# EAGLE design ProyectoFinal2 (EAGLE 9.4.0)
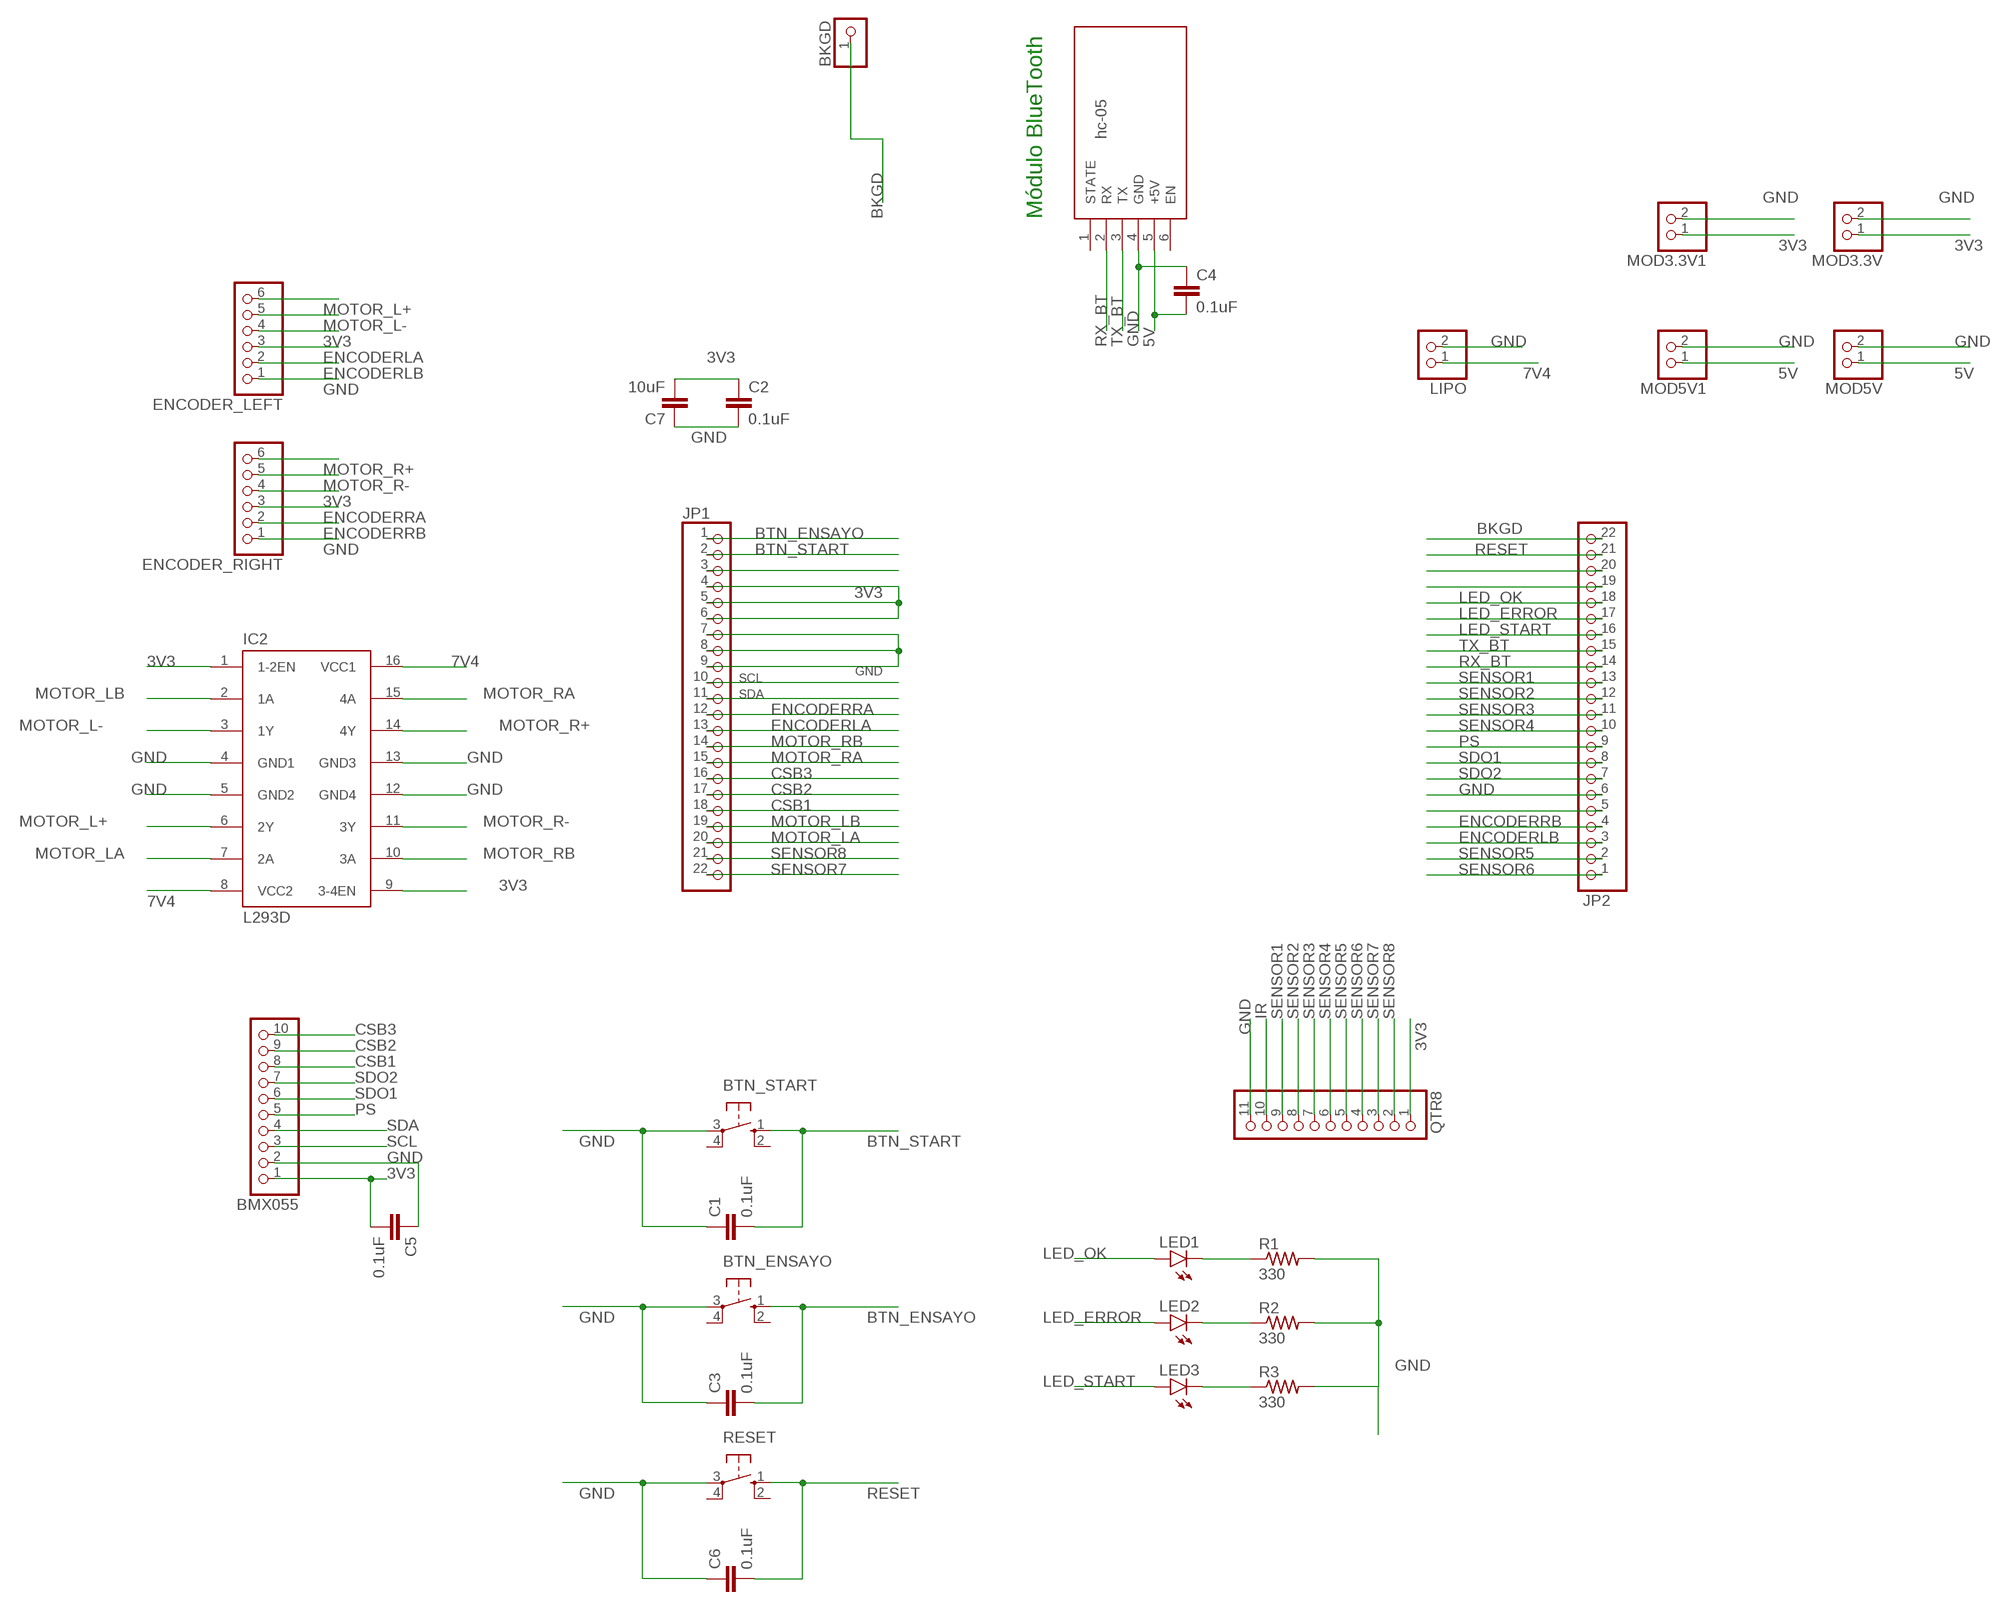
[diagram p0: schematic, sheet 1]

## Parts
BKGD  PINHD-1X1  [1X01]
BLUETOOTH  hc-05  WIRELESS-BLUETOOTH-HC-05  [WIRELESS-BLUETOOTH-HC-05]
BMX055  PINHD-1X10  [1X10]
BTN_ENSAYO  10-XX  [B3F-10XX]
BTN_START  10-XX  [B3F-10XX]
C1  0.1uF  C-EUC0805K  [C0805K]
C2  0.1uF  C-EUC0805K  [C0805K]
C3  0.1uF  C-EUC0805K  [C0805K]
C4  0.1uF  C-EUC0805K  [C0805K]
C5  0.1uF  C-EUC0805K  [C0805K]
C6  0.1uF  C-EUC0805K  [C0805K]
C7  10uF  C-EUC1206K  [C1206K]
ENCODER_LEFT  PINHD-1X6  [1X06]
ENCODER_RIGHT  PINHD-1X6  [1X06]
IC2  L293D  [DIL16]
JP1  PINHD-1X22  [1X22]
JP2  PINHD-1X22  [1X22]
LED1  LED5MM  [LED5MM]
LED2  LED5MM  [LED5MM]
LED3  LED5MM  [LED5MM]
LIPO  PINHD-1X2  [1X02]
MOD3.3V  PINHD-1X2  [1X02]
MOD3.3V1  PINHD-1X2  [1X02]
MOD5V  PINHD-1X2  [1X02]
MOD5V1  PINHD-1X2  [1X02]
QTR8  PINHD-1X11  [1X11]
R1  330  R-US_R0805  [R0805]
R2  330  R-US_R0805  [R0805]
R3  330  R-US_R0805  [R0805]
RESET  10-XX  [B3F-10XX]

## Nets
3V3: BMX055.1 C2.1 C5.2 C7.2 ENCODER_LEFT.4 ENCODER_RIGHT.4 IC2.1(1-2EN) IC2.9(3-4EN) JP1.4 JP1.5 JP1.6 MOD3.3V1.1 MOD3.3V.1 QTR8.1
5V: BLUETOOTH.5(+5V) C4.2 MOD5V1.1 MOD5V.1
7V4: IC2.8(VCC2) IC2.16(VCC1) LIPO.1
BKGD: BKGD.1 JP2.22
BTN_ENSAYO: BTN_ENSAYO.1(S) C3.2 JP1.1
BTN_START: BTN_START.1(S) C1.2 JP1.2
CSB1: BMX055.8 JP1.18
CSB2: BMX055.9 JP1.17
CSB3: BMX055.10 JP1.16
ENCODERLA: ENCODER_LEFT.3 JP1.13
ENCODERLB: ENCODER_LEFT.2 JP2.3
ENCODERRA: ENCODER_RIGHT.3 JP1.12
ENCODERRB: ENCODER_RIGHT.2 JP2.4
GND: BLUETOOTH.4(GND) BMX055.2 BTN_ENSAYO.3(P) BTN_START.3(P) C1.1 C2.2 C3.1 C4.1 C5.1 C6.1 C7.1 ENCODER_LEFT.1 ENCODER_RIGHT.1 IC2.4(GND1) IC2.5(GND2) IC2.12(GND4) IC2.13(GND3) JP1.7 JP1.8 JP1.9 JP2.6 LIPO.2 MOD3.3V1.2 MOD3.3V.2 MOD5V1.2 MOD5V.2 QTR8.11 R1.2 R2.2 R3.2 RESET.3(P)
IR: QTR8.10
LED_ERROR: JP2.17 LED2.A
LED_OK: JP2.18 LED1.A
LED_START: JP2.16 LED3.A
MOTOR_L+: ENCODER_LEFT.6 IC2.6(2Y)
MOTOR_L-: ENCODER_LEFT.5 IC2.3(1Y)
MOTOR_LA: IC2.7(2A) JP1.20
MOTOR_LB: IC2.2(1A) JP1.19
MOTOR_R+: ENCODER_RIGHT.6 IC2.14(4Y)
MOTOR_R-: ENCODER_RIGHT.5 IC2.11(3Y)
MOTOR_RA: IC2.15(4A) JP1.15
MOTOR_RB: IC2.10(3A) JP1.14
N$1: LED1.K(C) R1.1
N$2: LED2.K(C) R2.1
N$3: JP1.3
N$4: LED3.K(C) R3.1
N$5: JP2.5
N$41: JP2.19
N$42: JP2.20
PS: BMX055.5 JP2.9
RESET: C6.2 JP2.21 RESET.1(S)
RX_BT: BLUETOOTH.2(RX) JP2.14
SCL: BMX055.3 JP1.10
SDA: BMX055.4 JP1.11
SDO1: BMX055.6 JP2.8
SDO2: BMX055.7 JP2.7
SENSOR1: JP2.13 QTR8.9
SENSOR2: JP2.12 QTR8.8
SENSOR3: JP2.11 QTR8.7
SENSOR4: JP2.10 QTR8.6
SENSOR5: JP2.2 QTR8.5
SENSOR6: JP2.1 QTR8.4
SENSOR7: JP1.22 QTR8.3
SENSOR8: JP1.21 QTR8.2
TX_BT: BLUETOOTH.3(TX) JP2.15
Unconnected: BLUETOOTH.1(STATE) BLUETOOTH.6(EN) BTN_ENSAYO.2(S1) BTN_ENSAYO.4(P1) BTN_START.2(S1) BTN_START.4(P1) RESET.2(S1) RESET.4(P1)

## Notes on the sheet
- Módulo BlueTooth

## Library data of the parts
BKGD = pinhead:PINHD-1X1: PIN HEADER
BLUETOOTH = diy-modules:WIRELESS-BLUETOOTH-HC-05: Bluetooth Transceiver Module based on HC-05 board Tutorial is available here: https://arduino-info.wikispaces.com/BlueTooth-HC05-HC06-Modules-How-To Click here to find device on ebay.com <http://www.ebay.com/sch/hc-05+module+rs232>
BMX055 = pinhead:PINHD-1X10: PIN HEADER
BTN_ENSAYO BTN_START RESET = switch-omron:10-XX: OMRON SWITCH; MPN: B3F-1000; OC_FARNELL: 176432; OC_NEWARK: 36M3542
C1-C7 = rcl:C-EU: CAPACITOR, European symbol; SPICEPREFIX: C
ENCODER_LEFT ENCODER_RIGHT = pinhead:PINHD-1X6: PIN HEADER
IC2 = st-microelectronics:L293D: PUSH-PULL 4 CHANNEL DRIVER; MPN: L293D; OC_FARNELL: 9589619; OC_NEWARK: 56P8249
JP1 JP2 = pinhead:PINHD-1X22: PIN HEADER
LED1-LED3 = led:LED: LED OSRAM: - CHIPLED LG R971, LG N971, LY N971, LG Q971, LY Q971, LO R971, LY R971 LH N974, LH R974 LS Q976, LO Q976, LY Q976 LO Q996 - Hyper CHIPLED LW Q18S LB Q993, LB Q99A, LB R99A - SideLED LS A670, LO A670, LY A670, LG A670, LP A670 LB A673, LV A673, LT A673, LW A673 LH A674 LY A675 LS A676, LA A676, LO A676, LY A676, LW A676 LS A679, LY A679, LG A679 - Hyper Micro SIDELED® LS Y876, LA Y876, LO Y876, LY Y876 LT Y87S - SmartLED LW L88C, LW L88S LB L89C, LB L89S, LG L890 LS L89K, LO L89K, LY L89K LS L896, LA L896, LO L896, LY L896 - TOPLED LS T670, LO T670, LY T670, LG T670, LP T670 LSG T670, LSP T670, LSY T670, LOP T670, LYG T670 LG T671, LOG T671, LSG T671 LB T673, LV T673, LT T673, LW T673 LH T674 LS T676, LA T676, LO T676, LY T676, LB T676, LH T676, LSB T676, LW T676 LB T67C, LV T67C, LT T67C, LS T67K, LO T67K, LY T67K, LW E67C LS E67B, LA E67B, LO E67B, LY E67B, LB E67C, LV E67C, LT E67C LW T67C LS T679, LY T679, LG T679 LS T770, LO T770, LY T770, LG T770, LP T770 LB T773, LV T773, LT T773, LW T773 LH T774 LS E675, LA E675, LY E675, LS T675 LS T776, LA T776, LO T776, LY T776, LB T776 LHGB T686 LT T68C, LB T68C - Hyper Mini TOPLED® LB M676 - Mini TOPLED Santana® LG M470 LS M47K, LO M47K, LY M47K Source: http://www.osram.convergy.de LUXEON: - LUMILED® LXK2-PW12-R00, LXK2-PW12-S00, LXK2-PW14-U00, LXK2-PW14-V00 LXK2-PM12-R00, LXK2-PM12-S00, LXK2-PM14-U00 LXK2-PE12-Q00, LXK2-PE12-R00, LXK2-PE12-S00, LXK2-PE14-T00, LXK2-PE14-U00 LXK2-PB12-K00, LXK2-PB12-L00, LXK2-PB12-M00, LXK2-PB14-N00, LXK2-PB14-P00, LXK2-PB14-Q00 LXK2-PR12-L00, LXK2-PR12-M00, LXK2-PR14-Q00, LXK2-PR14-R00 LXK2-PD12-Q00, LXK2-PD12-R00, LXK2-PD12-S00 LXK2-PH12-R00, LXK2-PH12-S00 LXK2-PL12-P00, LXK2-PL12-Q00, LXK2-PL12-R00 Source: www.luxeon.com KINGBRIGHT: KA-3528ASYC Source: www.kingbright.com
LIPO MOD3.3V MOD3.3V1 MOD5V MOD5V1 = pinhead:PINHD-1X2: PIN HEADER
QTR8 = pinhead:PINHD-1X11: PIN HEADER
R1-R3 = rcl:R-US_: RESISTOR, American symbol; SPICEPREFIX: R

## Board
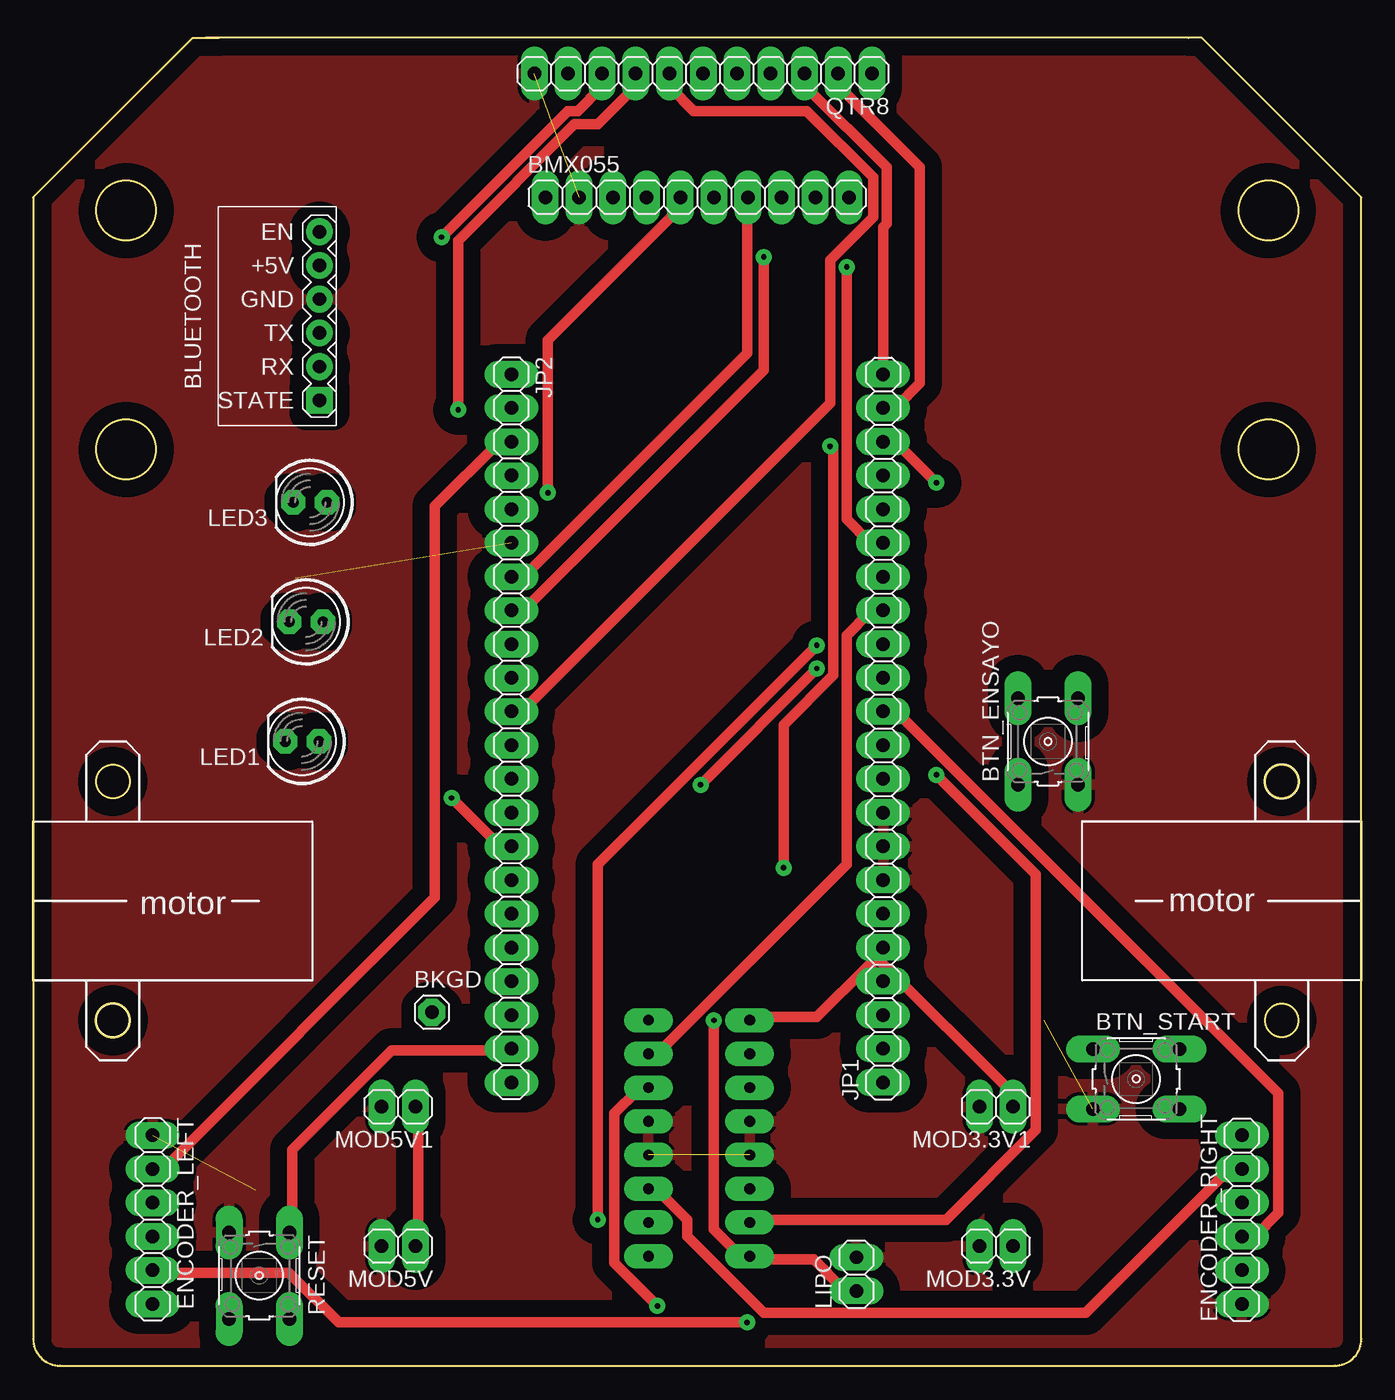
[diagram p1: board, top side]
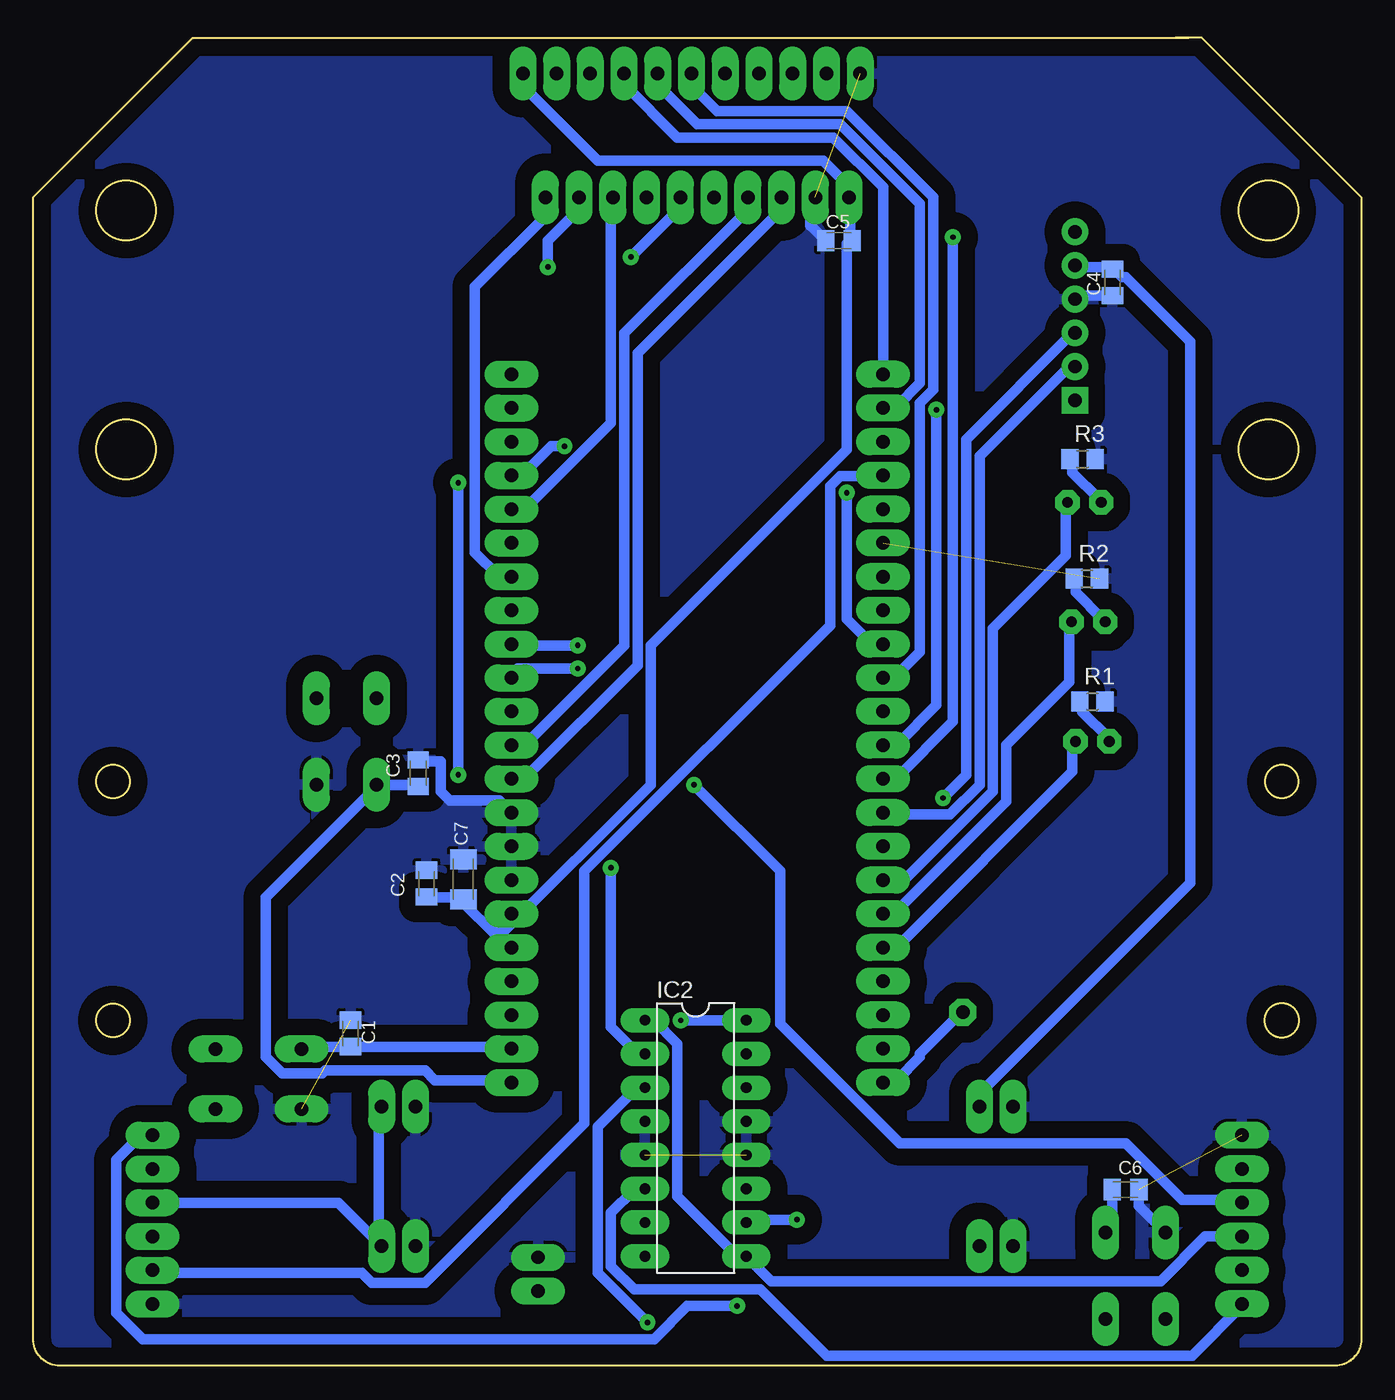
[diagram p2: board, bottom side, seen from below]

Size 100 x 100 mm. Coordinates in mm from the lower left corner, seen from the top.
Outline: 14,100 87,100 88,100 100,88 100,2 arc-90 98,0 2,0 arc-90 0,2 0,88 12,100
Outline: 14,100 13,100 12,100
Outline: 12,100 14,100
Outline: circle at 6,26 radius 1.27
Outline: circle at 6,44 radius 1.25
Outline: circle at 94,26 radius 1.25
Outline: circle at 94,44 radius 1.25
Outline: circle at 7,87 radius 2.24
Outline: circle at 7,69 radius 2.24
Outline: circle at 93,87 radius 2.24
Outline: circle at 93,69 radius 2.24
Copper layers (1*16): Top 0.035mm / dielectric 1.5mm / Bottom 0.035mm
Design rules "default *": minimum track width 0.8mm, minimum drill 0.4mm, track to track 0.2mm, track to pad 0.2mm, pad to pad 0.2mm, via to via 0.2mm, smd to smd 6mil, copper to edge 0.2mm, drill to drill 6mil, minimum pad ring 10mil, minimum via ring 8mil, stop-mask expansion 4mil, vias tented up to drill 0mil, thermal gap 10mil

### Footprints (pad centres in the part's own frame; a part is rotated, then mirrored left to right if it is on the bottom)
1X01 = drill 1.016 octagon: 1 0,0
WIRELESS-BLUETOOTH-HC-05 = drill 1 square: 1 -6.35,-3.175 | drill 1: 2 -3.81,-3.175; 3 -1.27,-3.175; 4 1.27,-3.175; 5 3.81,-3.175; 6 6.35,-3.175
1X10 = drill 1.016 long: 1 -11.43,0; 2 -8.89,0; 3 -6.35,0; 4 -3.81,0; 5 -1.27,0; 6 1.27,0; 7 3.81,0; 8 6.35,0; 9 8.89,0; 10 11.43,0
B3F-10XX = drill 1.016 long: 1 -3.251,2.261; 2 3.251,2.261; 3 -3.251,-2.261; 4 3.251,-2.261
C0805K = smd 1.3 x 1.6: 1 -1,0; 2 1,0
C1206K = smd 1.5 x 2: 1 -1.5,0; 2 1.5,0
1X06 = drill 1.016 long: 1 -6.35,0; 2 -3.81,0; 3 -1.27,0; 4 1.27,0; 5 3.81,0; 6 6.35,0
DIL16 = drill 0.813 long: 1 -8.89,-3.81; 2 -6.35,-3.81; 3 -3.81,-3.81; 4 -1.27,-3.81; 5 1.27,-3.81; 6 3.81,-3.81; 7 6.35,-3.81; 8 8.89,-3.81; 9 8.89,3.81; 10 6.35,3.81; 11 3.81,3.81; 12 1.27,3.81; 13 -1.27,3.81; 14 -3.81,3.81; 15 -6.35,3.81; 16 -8.89,3.81
1X22 = drill 1.016 long: 1 -26.67,0; 2 -24.13,0; 3 -21.59,0; 4 -19.05,0; 5 -16.51,0; 6 -13.97,0; 7 -11.43,0; 8 -8.89,0; 9 -6.35,0; 10 -3.81,0; 11 -1.27,0; 12 1.27,0; 13 3.81,0; 14 6.35,0; 15 8.89,0; 16 11.43,0; 17 13.97,0; 18 16.51,0; 19 19.05,0; 20 21.59,0; 21 24.13,0; 22 26.67,0
LED5MM = drill 0.813 octagon: A -1.27,0; K 1.27,0
1X02 = drill 1.016 long: 1 -1.27,0; 2 1.27,0
1X11 = drill 1.016 long: 1 -12.7,0; 2 -10.16,0; 3 -7.62,0; 4 -5.08,0; 5 -2.54,0; 6 0,0; 7 2.54,0; 8 5.08,0; 9 7.62,0; 10 10.16,0; 11 12.7,0
R0805 = smd 1.3 x 1.5: 1 -0.95,0; 2 0.95,0

### Placement (x,y rotation side)
BKGD  30.01,26.62 0 top
BLUETOOTH  18.38,79.05 90 top
BMX055  50,88 0 top
BTN_ENSAYO  76.41,47.01 90 top
BTN_START  83.04,21.59 0 top
C1  76.11,25.02 270 bottom
C2  70.39,36.31 90 bottom
C3  71.01,44.62 270 bottom
C4  18.74,81.59 90 bottom
C5  39.33,84.74 0 bottom
C6  17.75,13.26 180 bottom
C7  67.61,36.63 270 bottom
ENCODER_LEFT  9,11 270 top
ENCODER_RIGHT  91,11 90 top
IC2  50.13,17.13 270 bottom
JP1  64,48 90 top
JP2  36,48 270 top
LED1  20.25,47.02 180 top
LED2  20.55,56.02 180 top
LED3  20.85,65.02 180 top
LIPO  61.98,6.89 90 top
MOD3.3V  72.5,9 180 top
MOD3.3V1  72.5,19.5 180 top
MOD5V  27.5,9 180 top
MOD5V1  27.5,19.5 180 top
QTR8  50.44,97.31 180 top
R1  20.25,50.02 0 bottom
R2  20.67,59.27 0 bottom
R3  20.99,68.28 0 bottom
RESET  17.02,6.78 270 top

### Tracks (layer width: path | path; a pad name or v marks a point on that pad's centre or on a via)
3V3
  Top 0.8: 62.88,30.12 64,31.25 JP1.5 63.75,30.5 73.75,20.5 73.75,19.5 MOD3.3V1.1 | 62.88,30.12 59,26.25 54,26.25 IC2.1 | 62.88,30.12 64,29 JP1.4
  Bottom 0.8: ENCODER_LEFT.4 11.76,9.73 15.12,6.37 44.45,6.37 IC2.9 46.5,8.5 47.25,8.5 51.5,12.75 51.5,24.25 53.25,26 53.75,26 IC2.1 | ENCODER_RIGHT.4 77.04,12.27 MOD3.3V.1 74,9.75 74,19.5 MOD3.3V1.1 | QTR8.1 63,97.25 63,96.25 57.5,90.75 40.5,90.75 38.75,89 38.75,88.25 BMX055.1 38.5,88 38.5,84.75 C5.2 38.75,84.5 38.75,69 53.5,54.25 53.5,43.75 64.75,32.5 JP1.5 64,31.25 65.38,32.62 | C2.1 70.25,35.25 67.75,35.25 C7.2 67.5,34.75 65.38,32.62 | 65.38,32.62 64,34 JP1.6
5V
  Top 0.8: MOD5V.1 29,9 29,19.5 MOD5V1.1
  Bottom 0.8: BLUETOOTH.5 21.5,82.75 18.75,82.75 C4.2 18.5,82.5 18,82 17.75,82 12.88,77.12 12.88,36.38 28.75,20.5 28.75,19.5 MOD5V1.1
7V4  (via drill 0.4)
  Top 0.8: LIPO.1 61.75,5.75 61,5.75 58.75,8 54,8 IC2.8 53.75,7.75 51.25,10.25 v51.25,26
  Bottom 0.8: v51.25,26 46.5,26 IC2.16
BKGD
  Bottom 0.8: BKGD.1 30.25,26.5 33.25,23.5 33.25,23.25 35,21.5 36,21.5 JP2.22
BTN_ENSAYO
  Bottom 0.8: C3.2 71.25,43.75 74,43.75 BTN_ENSAYO.1 74.25,43.5 82.5,35.25 82.5,23.25 81.25,22 78.25,22 78,22.25 70.5,22.25 69.75,21.5 64,21.5 JP1.1
BTN_START
  Bottom 0.8: BTN_START.1 79.75,24 76.25,24 C1.2 75.75,24 64,24 JP1.2
CSB1
  Bottom 0.8: JP1.18 64,64.75 62.75,64.75 56.5,71 56.5,88 BMX055.8
CSB2  (via drill 0.4)
  Top 0.8: v61.25,82.75 61.25,63.75 63,62 64,62 JP1.17
  Bottom 0.8: v61.25,82.75 61.25,84.75 59,87 59,88 BMX055.9
CSB3
  Bottom 0.8: JP1.16 64,59.5 65,59.5 66.75,61.25 66.75,81.25 61.5,86.5 61.5,88 BMX055.10
ENCODERLA  (via drill 0.4)
  Top 0.8: v59,52.5 v50.25,43.75
  Bottom 0.8: v50.25,43.75 43.75,37.25 43.75,25.75 34.75,16.75 17.75,16.75 13.5,12.5 9,12.5 ENCODER_LEFT.3 | v59,52.5 63.5,52.5 64,52 JP1.13
ENCODERLB
  Top 0.8: ENCODER_LEFT.2 9,15 10,15 30.25,35.25 30.25,64.75 35,69.5 36,69.5 JP2.3
ENCODERRA
  Top 0.8: ENCODER_RIGHT.3 91,9.75 92,9.75 93.75,11.5 93.75,20.5 65,49.25 64,49.25 JP1.12
ENCODERRB
  Bottom 0.8: ENCODER_RIGHT.2 91,7 75.25,7 74.5,6.25 70.5,6.25 58.5,18.25 58.5,37.25 40,55.75 40,66.25 39.25,67 36,67 JP2.4
GND  (5 unrouted)
  Bottom 0.8: RESET.3 16.75,12.02 C6.1 | C4.1 21.29,80.59 BLUETOOTH.4 | JP1.9 64.92,42.57 68.65,42.57 69.33,43.25 69.33,45.49 70.89,45.49 C3.1 | C5.1 41.47,85.88 41.5,85.88 41.5,87.61 BMX055.2
  pour Bottom (isolate 1.27): -2,88 -2,101 102,101 102,-2 -3,-2 -3,88
  pour Top (isolate 1.27): -4,88 -4,102 105,102 105,-4 94,-4 -5,-4 -5,87 -4,87
LED_ERROR
  Bottom 0.8: LED2.A 22,56 22,51.5 26.75,46.75 26.75,42.5 35,34.25 36,34.25 JP2.17
LED_OK
  Bottom 0.8: LED1.A 21.75,47 21.75,44.75 35,31.5 JP2.18
LED_START
  Bottom 0.8: LED3.A 22.25,65 22.25,61 27.75,55.5 27.75,43.25 34.25,36.75 36,36.75 JP2.16
MOTOR_L+
  Bottom 0.8: IC2.6 54,13.25 54.75,13.25 56.5,11.5 56.5,7.5 54.75,5.75 45.25,5.75 40.25,0.75 12.75,0.75 9,4.5 ENCODER_LEFT.6
MOTOR_L-  (via drill 0.4)
  Top 0.8: v53.75,3.25 23,3.25 19.25,7 9,7 ENCODER_LEFT.5
  Bottom 0.8: v53.75,3.25 57.5,7 57.5,18 54.75,20.75 54,20.75 IC2.3
MOTOR_LA  (via drill 0.4)
  Top 0.8: v68,44.5 75.5,37 75.5,17.75 68.75,11 54,11 IC2.7 | v68,66.5 65,69.5 64,69.5 JP1.20
  Bottom 0.8: v68,66.5 v68,44.5
MOTOR_LB  (via drill 0.4)
  Top 0.8: v56.5,37.5 56.5,48.25 60.25,52 60.25,69 v60,69.25
  Bottom 0.8: v56.5,37.5 56.5,25.5 54.5,23.5 54,23.5 IC2.2 | v60,69.25 61,69.25 63,67.25 64,67.25 JP1.19
MOTOR_R+  (via drill 0.4)
  Top 0.8: v47,4.5 43.75,7.75 43.75,19 45.5,20.75 46.25,20.75 IC2.14
  Bottom 0.8: v47,4.5 50.75,4.5 53.25,2 91.75,2 93.75,4 93.75,15.5 92,17.25 91,17.25 ENCODER_RIGHT.6
MOTOR_R-
  Top 0.8: IC2.11 46.5,13.25 47,13.25 49.25,11 49.25,9.75 55,4 79.25,4 90,14.75 91,14.75 ENCODER_RIGHT.5
MOTOR_RA
  Top 0.8: IC2.15 46.5,23.5 47,23.5 61.25,37.75 61.25,55 63,56.75 64,56.75 JP1.15
MOTOR_RB  (via drill 0.4)
  Top 0.8: v42.5,11 42.5,37.75 v59,54.25
  Bottom 0.8: v42.5,11 46.25,11 IC2.10 | v59,54.25 64,54.25 JP1.14
N$1
  Bottom 0.8: R1.1 21,50 21,49.25 19,47.25 LED1.K
N$2
  Bottom 0.8: R2.1 21.5,59.25 21.5,58.25 19.5,56.25 LED2.K
N$4
  Bottom 0.8: R3.1 21.75,68.25 21.75,67.25 19.75,65.25 LED3.K
PS  (via drill 0.4)
  Top 0.8: v38.75,65.75 38.75,77.25 48.5,87 48.5,88 BMX055.5
  Bottom 0.8: v38.75,65.75 38.75,56.25 37,54.5 36,54.5 JP2.9
RESET
  Top 0.8: JP2.21 36,23.75 27,23.75 19.5,16.25 19.5,10.25 RESET.1
  Bottom 0.8: C6.2 18.75,10.75 19.25,10.25 RESET.1
RX_BT
  Bottom 0.8: BLUETOOTH.2 21.75,75 22.25,75 28.75,68.5 28.75,43.75 31,41.5 36,41.5 JP2.14
SCL
  Bottom 0.8: JP1.10 64,44.25 63,44.25 54.5,52.75 54.5,76.25 43.75,87 43.75,88 BMX055.3
SDA
  Bottom 0.8: JP1.11 64,46.75 63,46.75 55.5,54.25 55.5,77.75 46.25,87 46.25,88 BMX055.4
SDO1  (via drill 0.4)
  Top 0.8: v55,83.5 55,75 37,57 36,57 JP2.8
  Bottom 0.8: v55,83.5 51.5,87 51.5,88 BMX055.6
SDO2
  Top 0.8: JP2.7 36,59.5 37,59.5 53.75,76.25 53.75,88 BMX055.7
SENSOR1  (via drill 0.4)
  Top 0.8: v30.75,85 40.25,94.5 41,94.5 42.75,96.25 42.75,97.25 QTR8.9
  Bottom 0.8: v30.75,85 30.75,48.5 35,44.25 36,44.25 JP2.13
SENSOR2  (via drill 0.4)
  Top 0.8: v32,72 32,84.75 40.75,93.5 42.5,93.5 45.25,96.25 45.25,97.25 QTR8.8
  Bottom 0.8: v32,72 32,49.75 35,46.75 36,46.75 JP2.12
SENSOR3
  Top 0.8: JP2.11 36,49.5 37,49.5 60,72.5 60,83.25 63.25,86.5 63.25,89.5 58.25,94.5 49.75,94.5 48,96.25 48,97.25 QTR8.7
SENSOR4
  Bottom 0.8: JP2.10 36,52 35,52 33.25,53.75 33.25,72.5 32.25,73.5 32.25,88 38.75,94.5 48.5,94.5 50.25,96.25 50.25,97.25 QTR8.6
SENSOR5
  Bottom 0.8: JP2.2 36,72.25 35,72.25 33.25,74 33.25,87.5 39.25,93.5 50,93.5 52.75,96.25 52.75,97.25 QTR8.5
SENSOR6
  Bottom 0.8: JP2.1 36,88.75 39.75,92.5 51.5,92.5 55.5,96.5 55.5,97.25 QTR8.4
SENSOR7
  Top 0.8: JP1.22 64,85.75 64.25,86 64.25,90.25 58.25,96.25 58.25,97.25 QTR8.3
SENSOR8
  Top 0.8: JP1.21 64,72.25 65,72.25 66.75,74 66.75,90.25 60.75,96.25 60.75,97.25 QTR8.2
TX_BT  (via drill 0.4)
  Top 0.8: v31.5,42.75 35,39.25 36,39.25 JP2.15
  Bottom 0.8: v31.5,42.75 29.75,44.5 29.75,69.75 21.75,77.75 BLUETOOTH.3

### Text on the board
tPlace: motor | motor